# EAGLE design iSensor_SPI_Buffer_RevB (EAGLE 9.6.2)

## Sheet 1 of 3
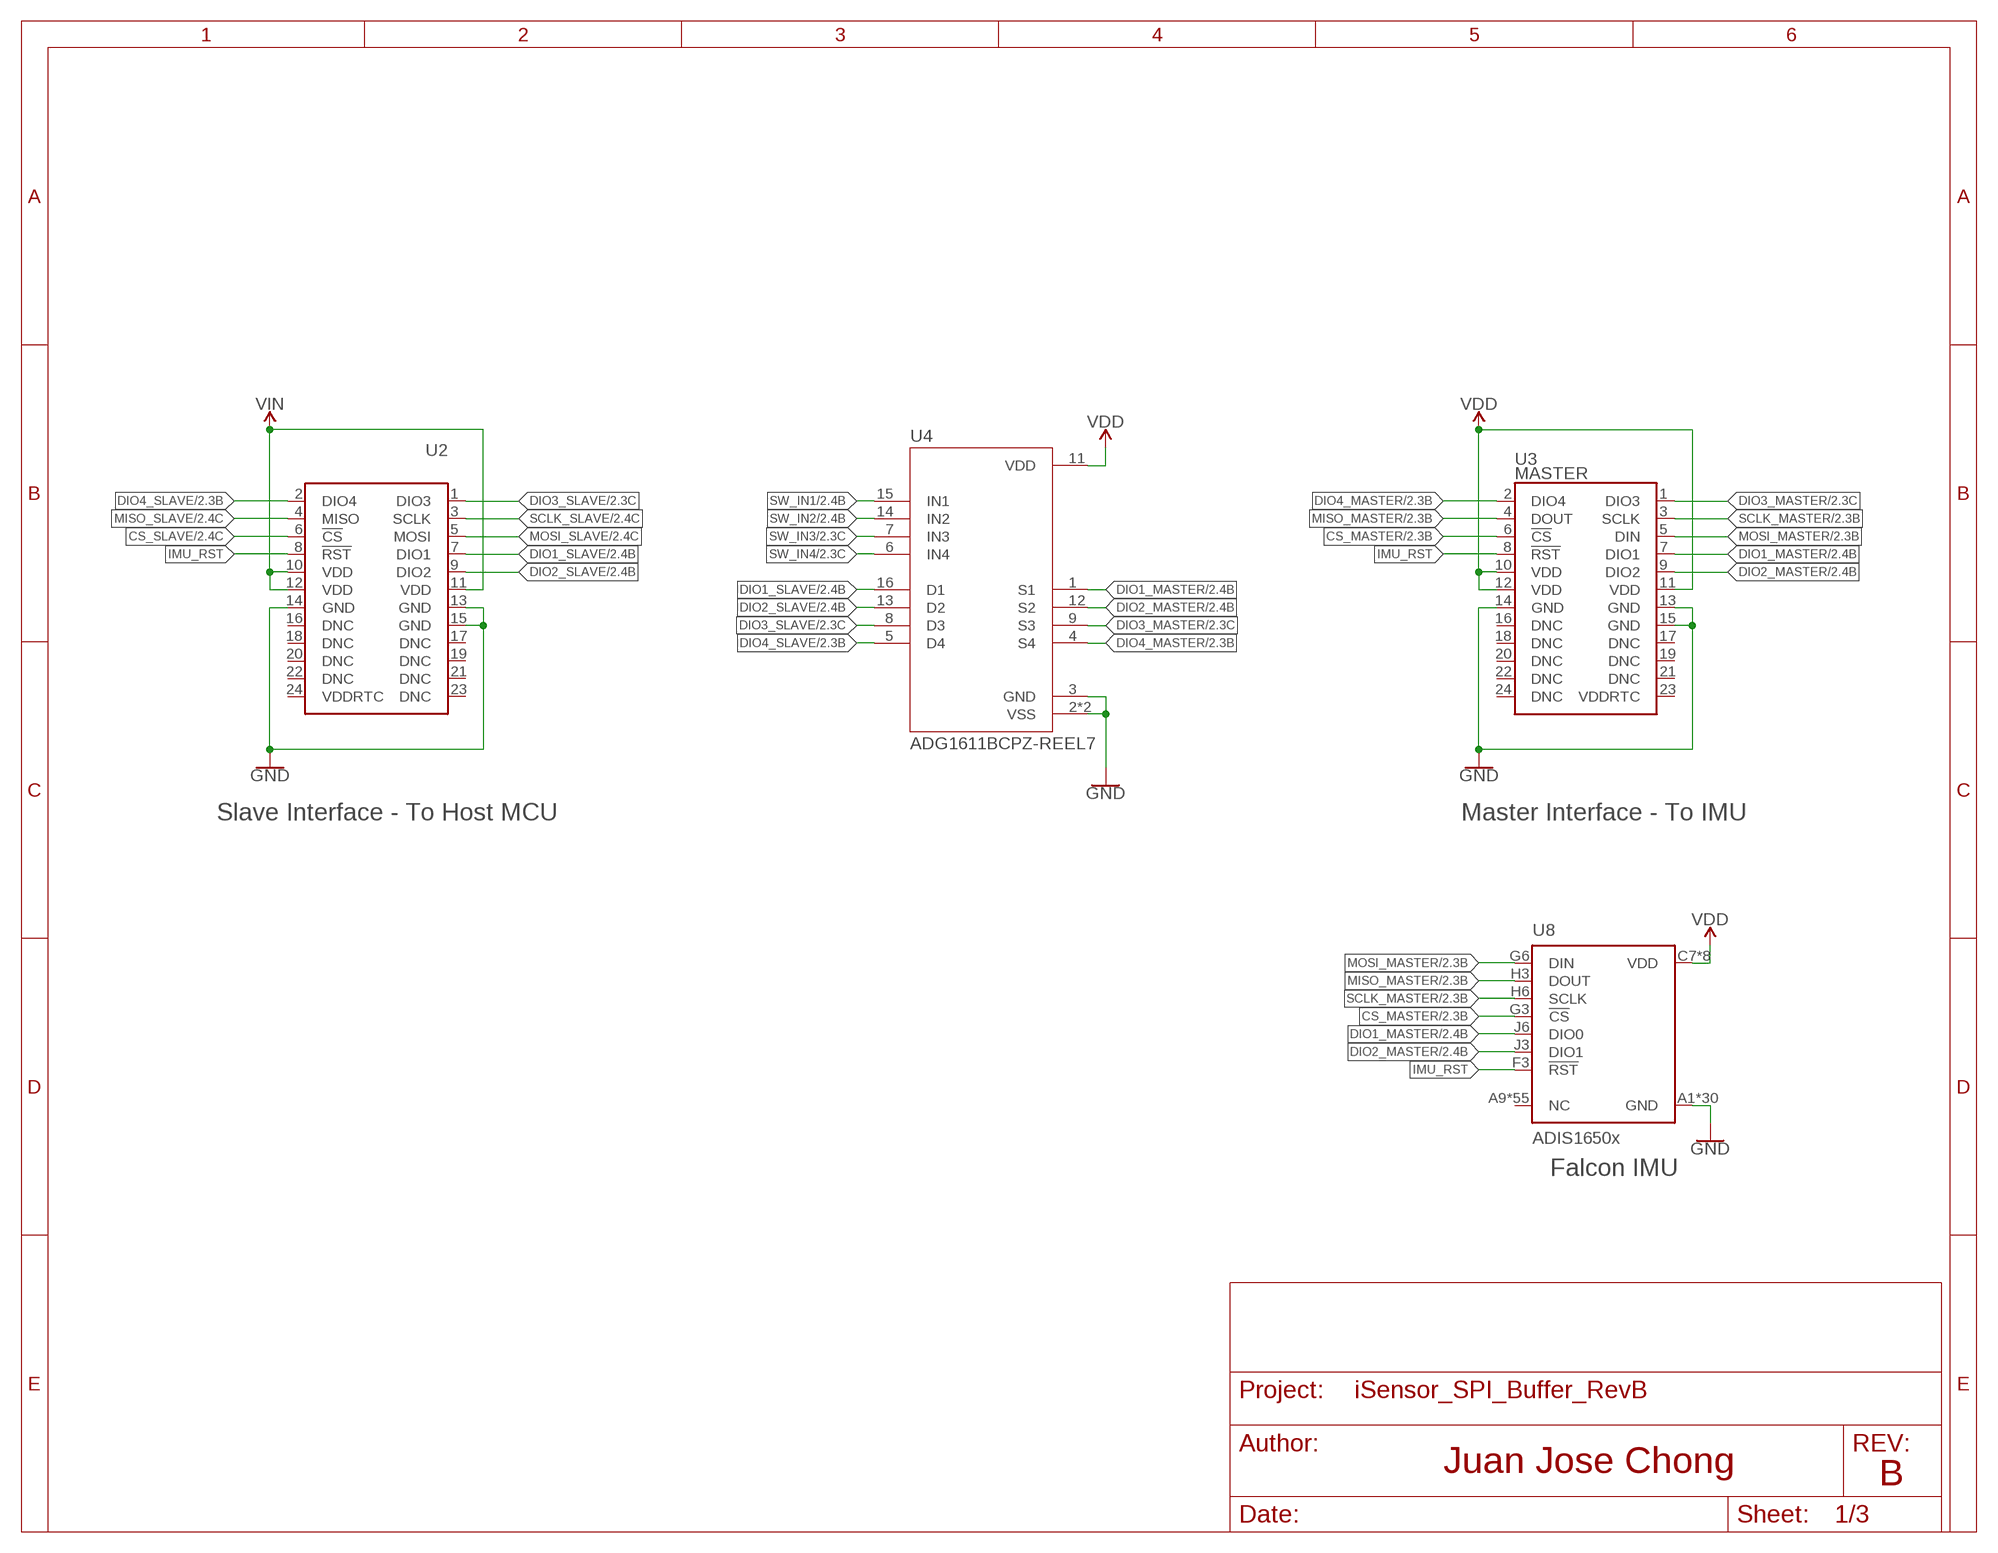
[diagram p0: schematic, sheet 1]

### Parts
U2  MW-12-03-H-D-130-112  [MW-12-03-H-D-130-112]
U3  MASTER  ADIS1648X  [ADIS1648X]
U4  ADG1611BCPZ-REEL7  [QFN65P400X400X80-17N]
U8  ADIS1650x  ADIS1650X  [ADIS1650X]

### Nets
CS_MASTER: U3.6(!CS) U8.G3(!CS) ; also sheet 2
CS_SLAVE: U2.6(!CS) ; also sheet 2
DIO1_MASTER: U3.7(DIO1) U4.1(S1) U8.J6(DIO0) ; also sheet 2
DIO1_SLAVE: U2.7(DIO1) U4.16(D1) ; also sheet 2
DIO2_MASTER: U3.9(DIO2) U4.12(S2) U8.J3(DIO1) ; also sheet 2
DIO2_SLAVE: U2.9(DIO2) U4.13(D2) ; also sheet 2
DIO3_MASTER: U3.1(DIO3) U4.9(S3) ; also sheet 2
DIO3_SLAVE: U2.1(DIO3) U4.8(D3) ; also sheet 2
DIO4_MASTER: U3.2(DIO4) U4.4(S4) ; also sheet 2
DIO4_SLAVE: U2.2(DIO4) U4.5(D4) ; also sheet 2
GND: U2.13(GND) U2.14(GND) U2.15(GND) U3.13(GND) U3.14(GND) U3.15(GND) U4.2(VSS) U4.3(GND) U4.17(VSS) U8.A1(GND) U8.A2(GND) U8.A3(GND) U8.A4(GND) U8.A5(GND) U8.A6(GND) U8.A7(GND) U8.A8(GND) U8.B3(GND) U8.B4(GND) U8.B5(GND) U8.B6(GND) U8.C2(GND) U8.C6(GND) U8.D3(GND) U8.E2(GND) U8.E6(GND) U8.E7(GND) U8.F1(GND) U8.F5(GND) U8.F6(GND) U8.F8(GND) U8.G2(GND) U8.G7(GND) U8.H8(GND) U8.J2(GND) U8.J7(GND) U8.K1(GND) U8.K3(GND) U8.K8(GND) ; also sheet 2,3
IMU_RST: U2.8(!RST) U3.8(!RST) U8.F3(!RST)
MISO_MASTER: U3.4(DOUT) U8.H3(DOUT) ; also sheet 2
MISO_SLAVE: U2.4(MISO) ; also sheet 2
MOSI_MASTER: U3.5(DIN) U8.G6(DIN) ; also sheet 2
MOSI_SLAVE: U2.5(MOSI) ; also sheet 2
SCLK_MASTER: U3.3(SCLK) U8.H6(SCLK) ; also sheet 2
SCLK_SLAVE: U2.3(SCLK) ; also sheet 2
SW_IN1: U4.15(IN1) ; also sheet 2
SW_IN2: U4.14(IN2) ; also sheet 2
SW_IN3: U4.7(IN3) ; also sheet 2
SW_IN4: U4.6(IN4) ; also sheet 2
VDD: U3.10(VDD) U3.11(VDD) U3.12(VDD) U4.11(VDD) U8.C7(VDD) U8.D6(VDD) U8.E3(VDD) U8.G1(VDD) U8.H1(VDD) U8.J4(VDD) U8.J5(VDD) U8.K6(VDD) ; also sheet 2,3
VIN: U2.10(VDD) U2.11(VDD) U2.12(VDD) ; also sheet 3
Unconnected: U2.16(DNC) U2.17(DNC) U2.18(DNC) U2.19(DNC) U2.20(DNC) U2.21(DNC) U2.22(DNC) U2.23(DNC) U2.24(VDDRTC) U3.16(DNC) U3.17(DNC) U3.18(DNC) U3.19(DNC) U3.20(DNC) U3.21(DNC) U3.22(DNC) U3.23(VDDRTC) U3.24(DNC) U8.A9(NC) U8.A10(NC) U8.B1(NC) U8.B2(NC) U8.B7(NC) U8.B8(NC) U8.B9(NC) U8.B10(NC) U8.C1(NC) U8.C3(NC) U8.C4(NC) U8.C5(NC) U8.C8(NC) U8.C9(NC) U8.C10(NC) U8.D1(NC) U8.D2(NC) U8.D4(NC) U8.D5(NC) U8.D7(NC) U8.D8(NC) U8.D9(NC) U8.D10(NC) U8.E1(NC) U8.E4(NC) U8.E5(NC) U8.E8(NC) U8.E9(NC) U8.E10(NC) U8.F2(NC) U8.F4(NC) U8.F7(NC) U8.F9(NC) U8.F10(NC) U8.G4(NC) U8.G5(NC) U8.G8(NC) U8.G9(NC) U8.G10(NC) U8.H2(NC) U8.H4(NC) U8.H5(NC) U8.H7(NC) U8.H9(NC) U8.H10(NC) U8.J1(NC) U8.J8(NC) U8.J9(NC) U8.J10(NC) U8.K2(NC) U8.K4(NC) U8.K5(NC) U8.K7(NC) U8.K9(NC) U8.K10(NC)

### Notes on the sheet
- Slave Interface - To Host MCU | Master Interface - To IMU
- Falcon IMU
- B

## Sheet 2 of 3
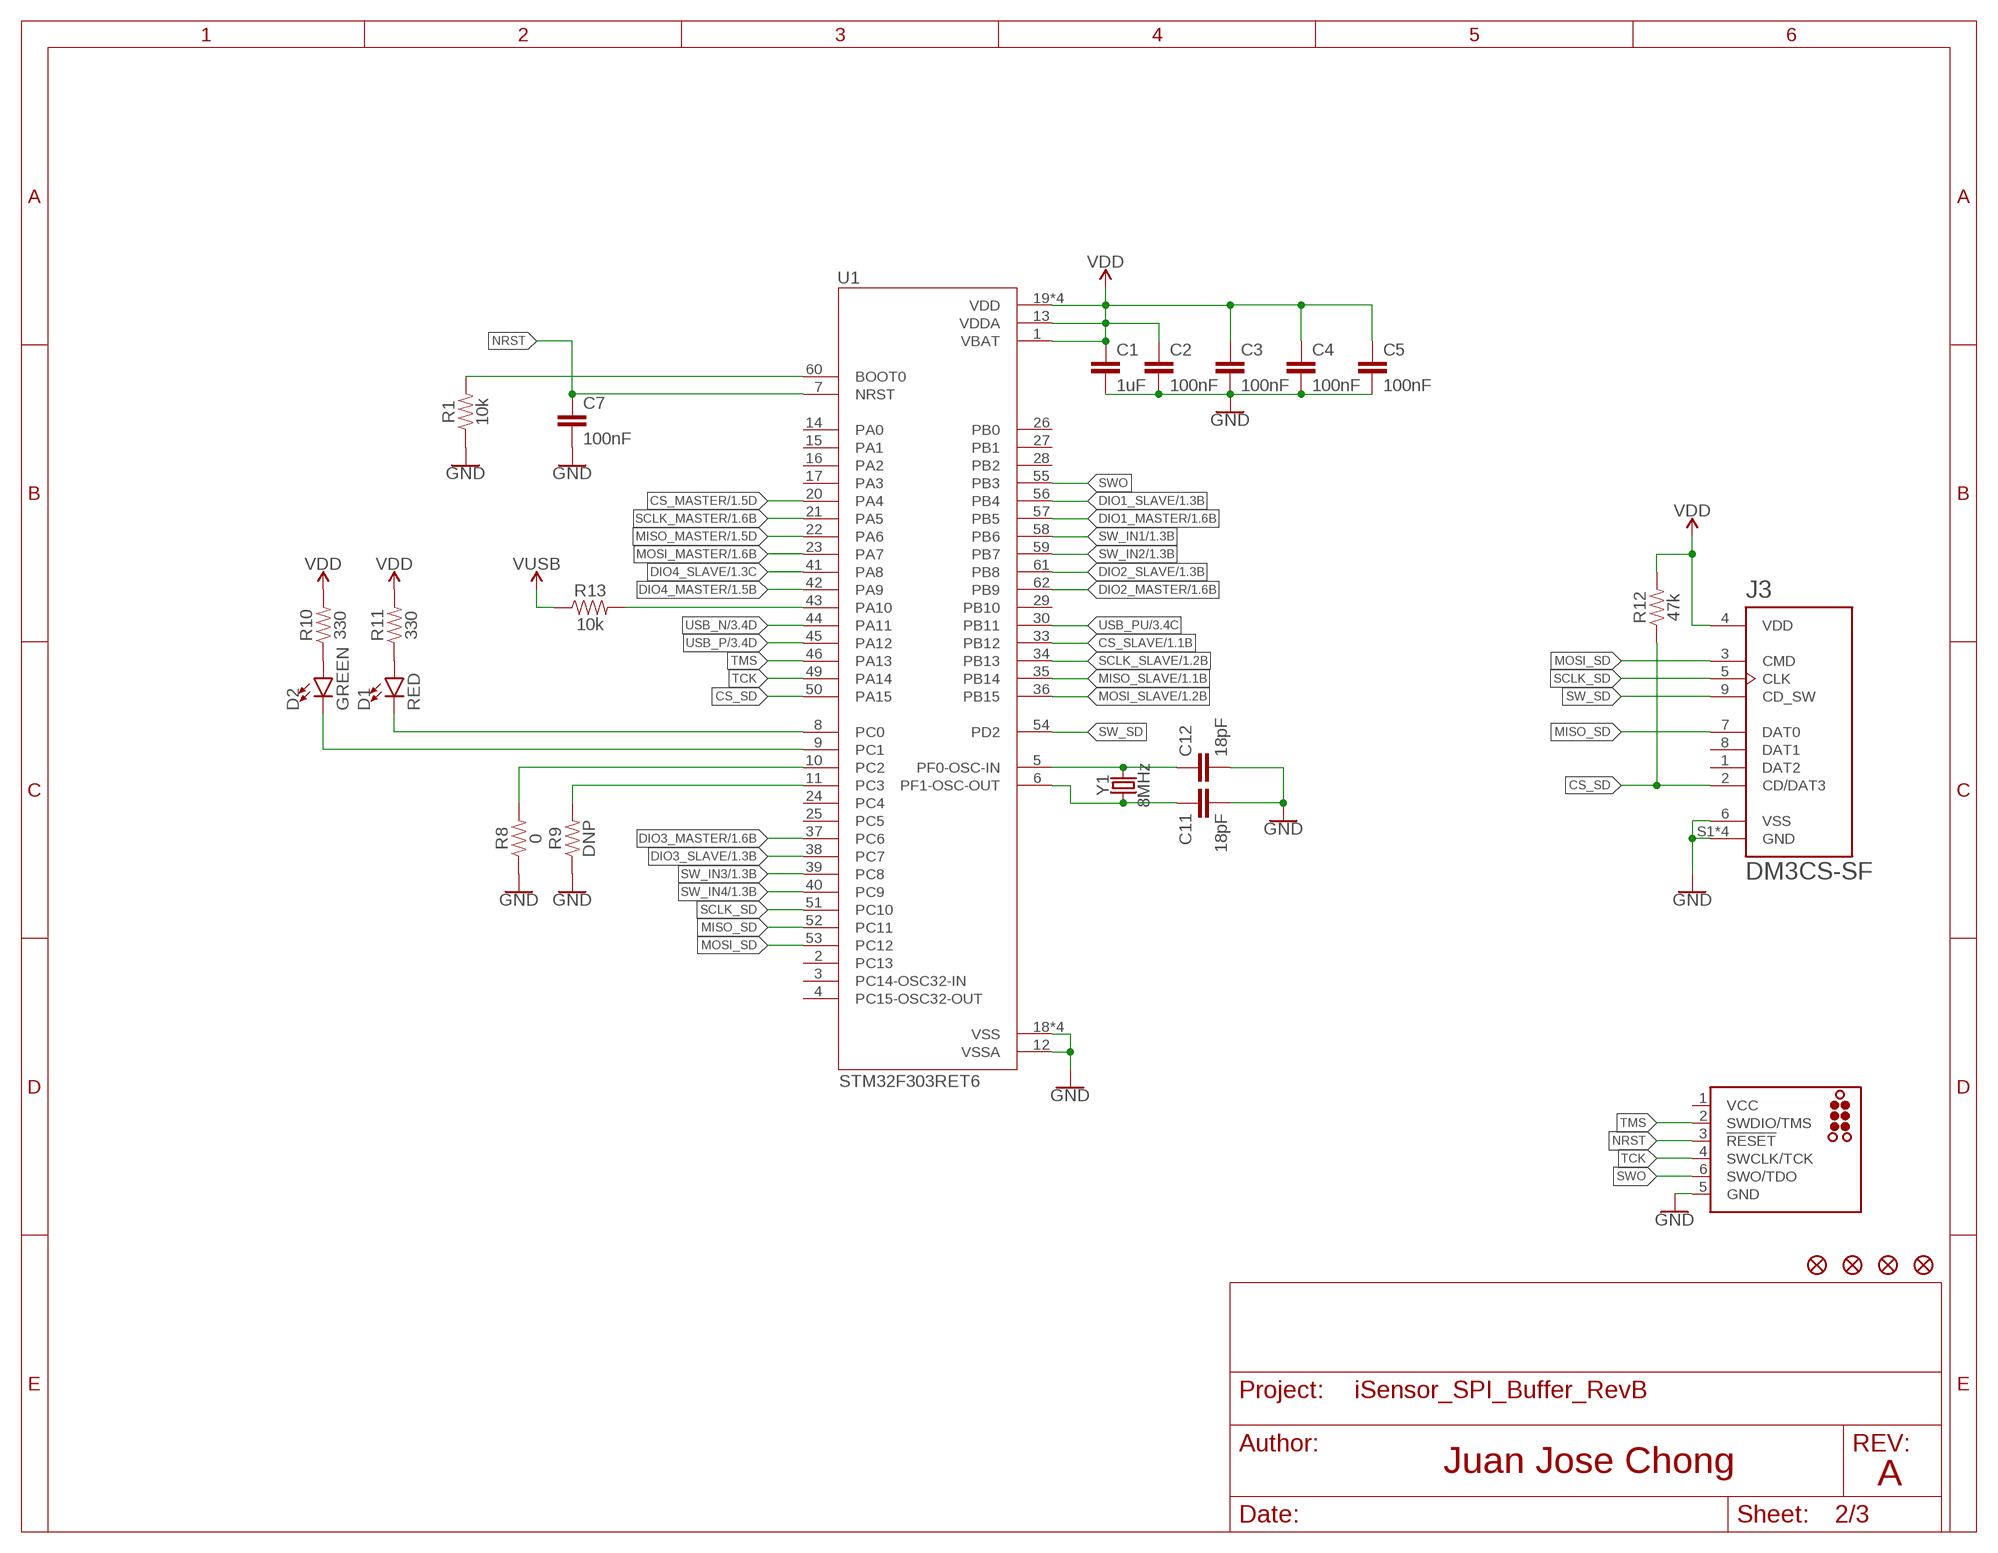
[diagram p1: schematic, sheet 2]

### Parts
C1  1uF  CAP-0603  [0603]
C2  100nF  CAP-0603  [0603]
C3  100nF  CAP-0603  [0603]
C4  100nF  CAP-0603  [0603]
C5  100nF  CAP-0603  [0603]
C7  100nF  CAP-0603  [0603]
C11  18pF  CAP-0402  [0402]
C12  18pF  CAP-0402  [0402]
D1  RED  LED-RED0603  [LED-0603]
D2  GREEN  LED-GREEN0603  [LED-0603]
FD1  FIDUCIAL1X2  [FIDUCIAL-1X2]
FD2  FIDUCIAL1X2  [FIDUCIAL-1X2]
FD3  FIDUCIAL1X2  [FIDUCIAL-1X2]
FD4  FIDUCIAL1X2  [FIDUCIAL-1X2]
J1  TC2030_SWD-MCP  [TC2030-MCP]
J3  DM3CS-SF  [HRS_DM3CS-SF]
R1  10k  RESISTOR0402  [0402]
R8  0  RESISTOR0402  [0402]
R9  DNP  RESISTOR0402  [0402]
R10  330  RESISTOR0402  [0402]
R11  330  RESISTOR0402  [0402]
R12  47k  RESISTOR0402  [0402]
R13  10k  RESISTOR0402  [0402]
U1  STM32F303RET6  [QFP50P1200X1200X160-64N]
Y1  8MHz  CRYSTAL-8MHZSMD-5X3.2  [CRYSTAL-SMD-5X3.2-4PAD]

### Nets
CS_MASTER: U1.20(PA4) ; also sheet 1
CS_SD: J3.2(CD/DAT3) R12.1 U1.50(PA15)
CS_SLAVE: U1.33(PB12) ; also sheet 1
DIO1_MASTER: U1.57(PB5) ; also sheet 1
DIO1_SLAVE: U1.56(PB4) ; also sheet 1
DIO2_MASTER: U1.62(PB9) ; also sheet 1
DIO2_SLAVE: U1.61(PB8) ; also sheet 1
DIO3_MASTER: U1.37(PC6) ; also sheet 1
DIO3_SLAVE: U1.38(PC7) ; also sheet 1
DIO4_MASTER: U1.42(PA9) ; also sheet 1
DIO4_SLAVE: U1.41(PA8) ; also sheet 1
GND: C1.2 C2.2 C3.2 C4.2 C5.2 C7.2 C11.2 C12.2 J1.5(GND) J3.6(VSS) J3.S1(GND) J3.S2(GND) J3.S3(GND) J3.S5(GND) R1.1 R8.1 R9.1 U1.12(VSSA) U1.18(VSS) U1.31(VSS) U1.47(VSS) U1.63(VSS) ; also sheet 1,3
MISO_MASTER: U1.22(PA6) ; also sheet 1
MISO_SD: J3.7(DAT0) U1.52(PC11)
MISO_SLAVE: U1.35(PB14) ; also sheet 1
MOSI_MASTER: U1.23(PA7) ; also sheet 1
MOSI_SD: J3.3(CMD) U1.53(PC12)
MOSI_SLAVE: U1.36(PB15) ; also sheet 1
N$1: R1.2 U1.60(BOOT0)
N$7: D1.C U1.8(PC0)
N$8: D2.C U1.9(PC1)
N$9: R8.2 U1.10(PC2)
N$10: R9.2 U1.11(PC3)
N$11: D2.A R10.1
N$12: D1.A R11.1
N$13: R13.2 U1.43(PA10)
N$14: C11.1 U1.6(PF1-OSC-OUT) Y1.1
N$15: C12.1 U1.5(PF0-OSC-IN) Y1.3
NRST: C7.1 J1.3(!RESET) U1.7(NRST)
SCLK_MASTER: U1.21(PA5) ; also sheet 1
SCLK_SD: J3.5(CLK) U1.51(PC10)
SCLK_SLAVE: U1.34(PB13) ; also sheet 1
SW_IN1: U1.58(PB6) ; also sheet 1
SW_IN2: U1.59(PB7) ; also sheet 1
SW_IN3: U1.39(PC8) ; also sheet 1
SW_IN4: U1.40(PC9) ; also sheet 1
SW_SD: J3.9(CD_SW) U1.54(PD2)
SWO: J1.6(SWO/TDO) U1.55(PB3)
TCK: J1.4(SWCLK/TCK) U1.49(PA14)
TMS: J1.2(SWDIO/TMS) U1.46(PA13)
USB_N [usb]: U1.44(PA11) ; also sheet 3
USB_P [usb]: U1.45(PA12) ; also sheet 3
USB_PU: U1.30(PB11) ; also sheet 3
V_USB: R13.1 ; supply symbol labelled VUSB ; also sheet 3
VDD: C1.1 C2.1 C3.1 C4.1 C5.1 J3.4(VDD) R10.2 R11.2 R12.2 U1.1(VBAT) U1.13(VDDA) U1.19(VDD) U1.32(VDD) U1.48(VDD) U1.64(VDD) ; also sheet 1,3
Unconnected: J1.1(VCC) J3.1(DAT2) J3.8(DAT1) U1.2(PC13) U1.3(PC14-OSC32-IN) U1.4(PC15-OSC32-OUT) U1.14(PA0) U1.15(PA1) U1.16(PA2) U1.17(PA3) U1.24(PC4) U1.25(PC5) U1.26(PB0) U1.27(PB1) U1.28(PB2) U1.29(PB10)

### Notes on the sheet
- A

## Sheet 3 of 3
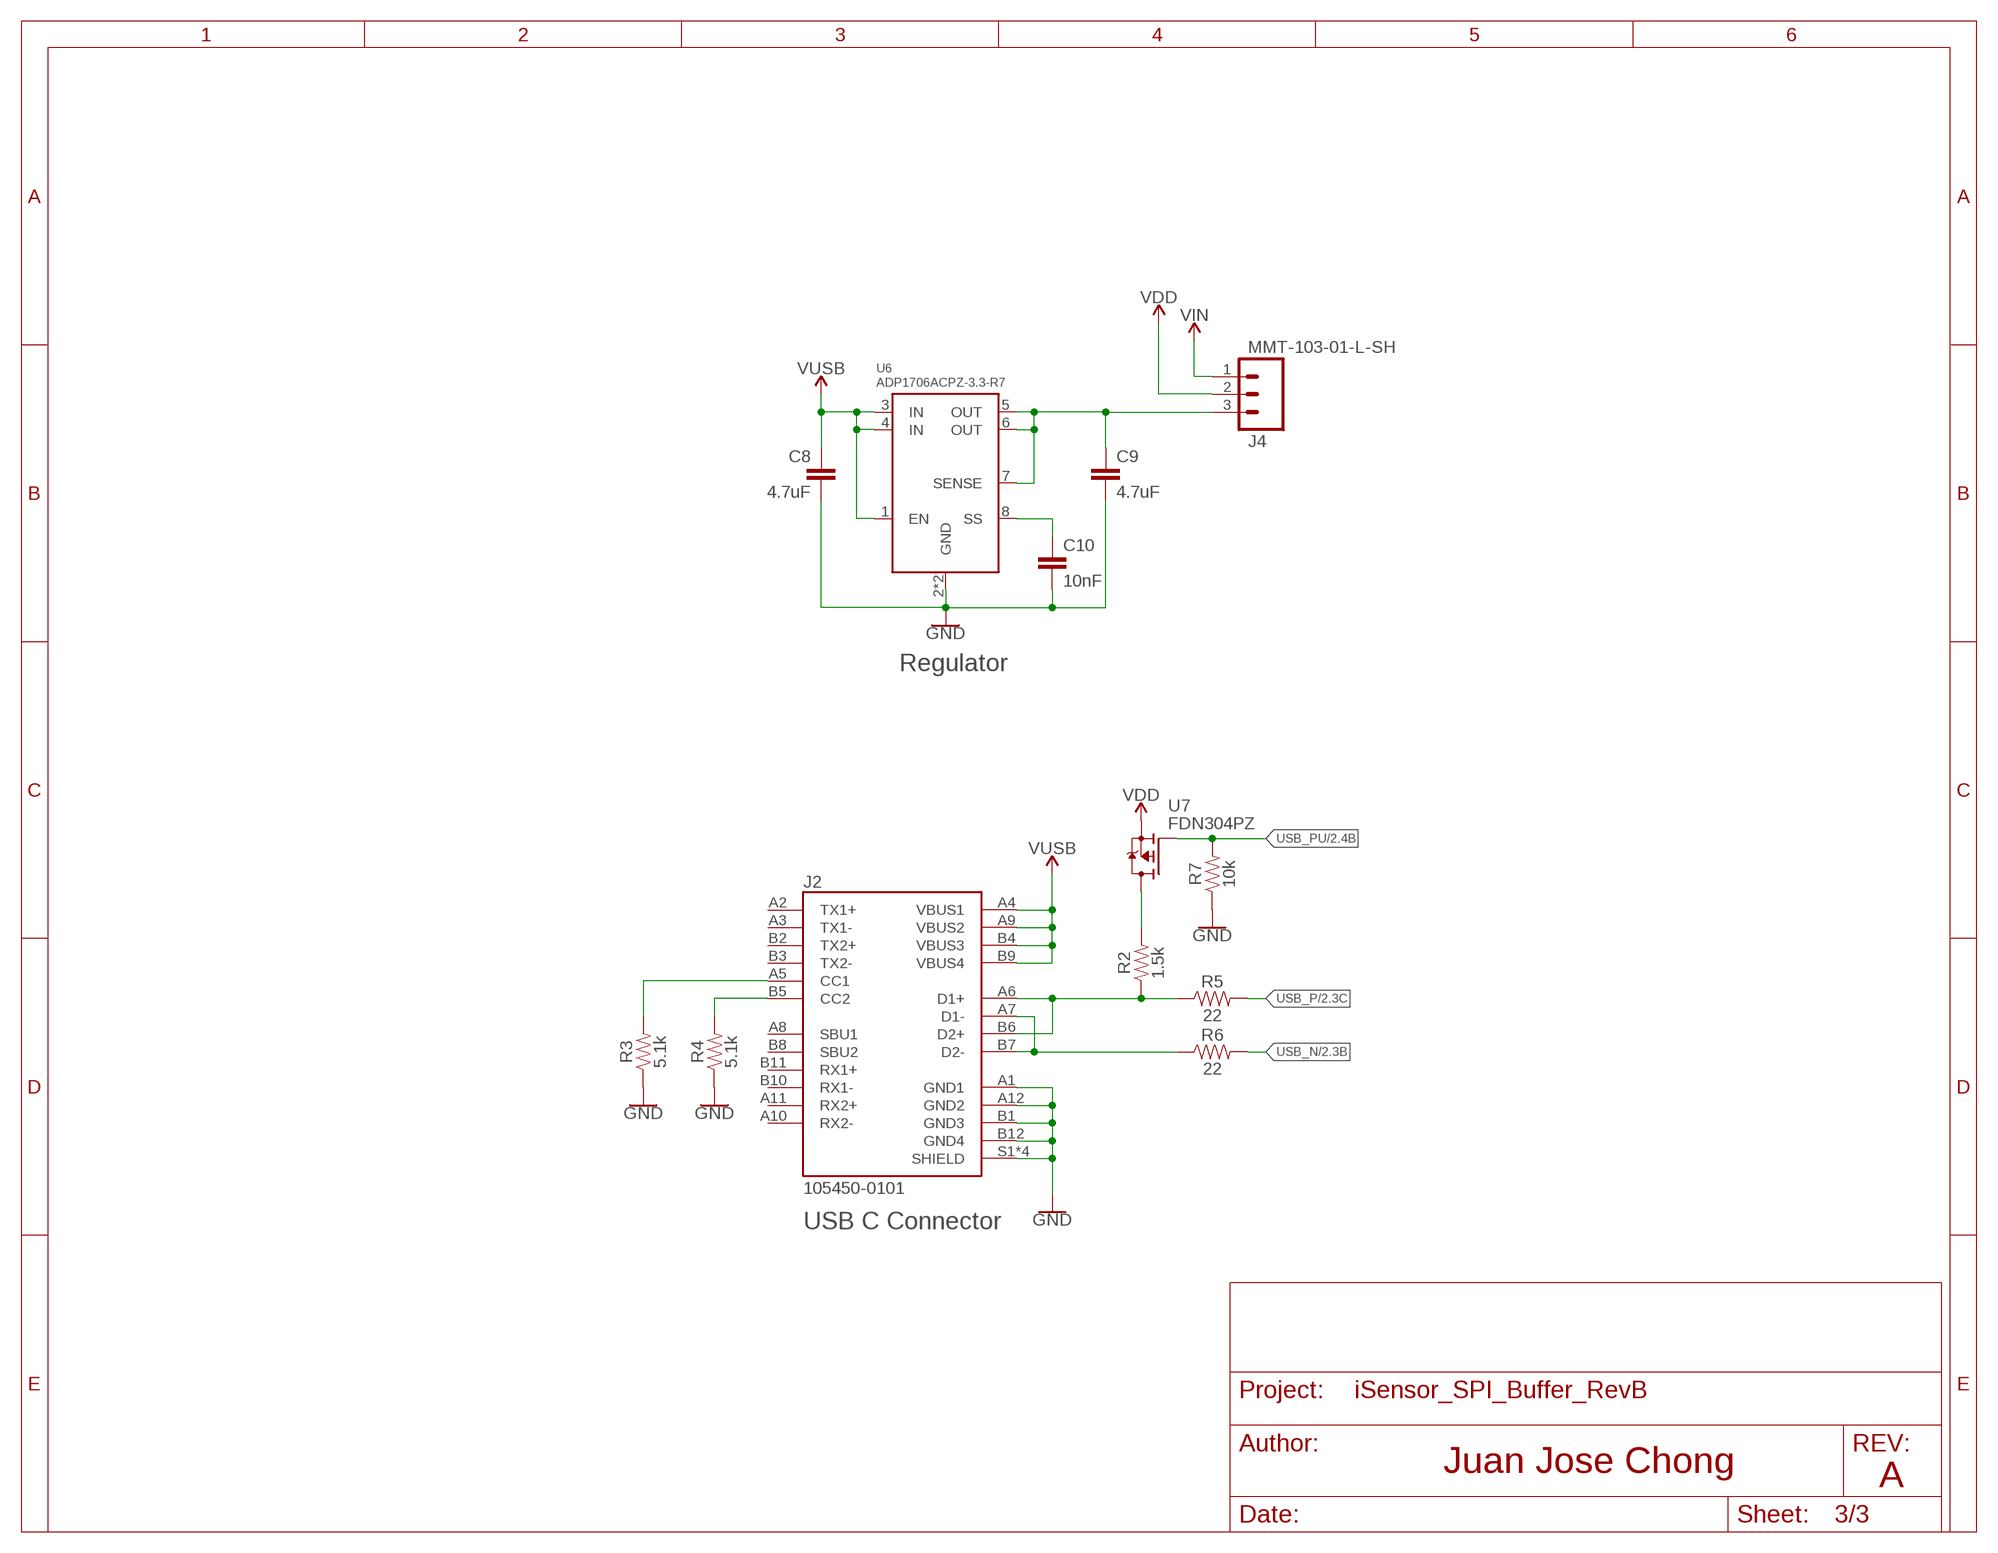
[diagram p2: schematic, sheet 3]

### Parts
C8  4.7uF  CAP-0805  [0805]
C9  4.7uF  CAP-0805  [0805]
C10  10nF  CAP-0603  [0603]
J2  105450-0101  [MOLEX_105450-0101]
J4  MMT-103-01-L-SH  M03MMT-103-01-L-SH  [SAMTEC-MMT-103-01-X-SH]
R2  1.5k  RESISTOR0402  [0402]
R3  5.1k  RESISTOR0402  [0402]
R4  5.1k  RESISTOR0402  [0402]
R5  22  RESISTOR0402  [0402]
R6  22  RESISTOR0402  [0402]
R7  10k  RESISTOR0402  [0402]
U6  ADP1706ACPZ-3.3-R7  [DFN300X300X90-9N]
U7  FDN304PZ  [SOT23]

### Nets
GND: C8.2 C9.2 C10.2 J2.A1(GND1) J2.A12(GND2) J2.B1(GND3) J2.B12(GND4) J2.S1(SHIELD) J2.S2(SHIELD) J2.S3(SHIELD) J2.S4(SHIELD) R3.1 R4.1 R7.1 U6.2(GND) U6.9(GND) ; also sheet 1,2
N$2: J2.A5(CC1) R3.2
N$3: J2.B5(CC2) R4.2
N$4: C9.1 J4.3 U6.5(OUT) U6.6(OUT) U6.7(SENSE)
N$5: R2.2 U7.3(D)
N$6: C10.1 U6.8(SS)
USB+_N [usb]: J2.A7(D1-) J2.B7(D2-) R6.1
USB+_P [usb]: J2.A6(D1+) J2.B6(D2+) R2.1 R5.1
USB_N [usb]: R6.2 ; also sheet 2
USB_P [usb]: R5.2 ; also sheet 2
USB_PU: R7.2 U7.1(G) ; also sheet 2
V_USB: C8.1 J2.A4(VBUS1) J2.A9(VBUS2) J2.B4(VBUS3) J2.B9(VBUS4) U6.1(EN) U6.3(IN) U6.4(IN) ; supply symbol labelled VUSB ; also sheet 2
VDD: J4.2 U7.2(S) ; also sheet 1,2
VIN: J4.1 ; also sheet 1
Unconnected: J2.A2(TX1+) J2.A3(TX1-) J2.A8(SBU1) J2.A10(RX2-) J2.A11(RX2+) J2.B2(TX2+) J2.B3(TX2-) J2.B8(SBU2) J2.B10(RX1-) J2.B11(RX1+)

### Notes on the sheet
- Regulator
- USB C Connector
- A

## Library data of the parts
C1-C5 C7-C12 = SparkFun-Capacitors:CAP
D1 = SparkFun-LED:LED-RED: Red SMD LED Used in manufacturing of most products at SparkFun Packages: 0603 - SMD 0603 package [Product Link] <http://docs.avagotech.com/docs/AV02-0551EN> 0603 SMART - SMD 0603 SMART package ( more efficient and expensive)[Product Link] <http://www.osram-os.com/Graphics/XPic2/00077099_0.pdf> 1206 - SMD1206 package [Product Link] <https://www.sparkfun.com/datasheets/DevTools/LilyPad/Q150OVS4.pdff> SparkFun Products: Pro Mini 328 -5V <https://www.sparkfun.com/products/821> RedBoard <https://www.sparkfun.com/products/12757> IOIO-OTG <https://www.sparkfun.com/products/13613>; PROD_ID: DIO-00819
D2 = SparkFun-LED:LED-GREEN: Green SMD LED Used in manufacturing of various products at SparkFun Packages: 0603 - SMD 0603 package [Product Link] <http://www.futureelectronics.com/en/technologies/semiconductors/optoelectronics/leds/Pages/9894312-LTST-C190GKT.aspx?CrossPart=HSMG-C190&IM=0> LilyPad 1206 - SMD1206 LilyPad package [Product Link] <http://www.futureelectronics.com/en/Technologies/Product.aspx?ProductID=IN150NGHARVATEKCORPORATION2049943&IM=0> 1206 - SMD1206 package [Product Link] <http://www.futureelectronics.com/en/technologies/semiconductors/optoelectronics/leds/Pages/8315665-LTST-C150KGKT.aspx?IM=0> 1206 Bottom Mount -SMD 1206 Bottom Mount [Product Link] <http://www.digikey.com/product-detail/en/lite-on-inc/LTST-C230KGKT/160-1456-1-ND/386854> SparkFun Products: Pro Mini 328 -5V <https://www.sparkfun.com/products/821> RedBoard <https://www.sparkfun.com/products/12757> MP3 Trigger <https://www.sparkfun.com/products/13720> Makey Makey <https://www.sparkfun.com/products/11076>; PROD_ID: DIO-00821
FD1-FD4 = SparkFun-Aesthetics:FIDUCIAL: Fiducial Alignment Points Point-of-reference for pick-and-place machines and other optical instruments.
J1 = tag-connect:TC2030_SWD: ARM20-CTX 20-Pin to TC2030-IDC Adapter for Cortex 6-Pin (TC2030-IDC family) </catalog/6> Cortex SWD </catalog/9> Adapters </adaptors> <javascript:void(0);> The Tag-Connect ARM20-CTX adapter board allows our TC2030-IDC cables to be used for ARM SWD (Single Wire Debug) applications. Although intended for use with our patented TC2030-IDC (and TC2030-IDC-NL) Plug-of-Nails™ Cables, the adapter may be useful to people wishing to use 6-pin 0.1” ribbon headers on their PCB instead of the traditional 20-Pin header. Please note the TC2030-IDC <http://tag-connect.com/TC2030-IDC> or TC2030-IDC-NL <http://tag-connect.com/TC2030-IDC-NL> cable is purchased separately, the cables and Segger JLINK seen in the pictures are not included! Download the Datasheet here. <http://www.tag-connect.com/Materials/ARM20-CTX.pdf>
J2 = 105450-0101:105450-0101: USB Shielded I/O Receptacle; Type C; Right Angle; Surface Mount; Gold over Nickel; AVAILABILITY: Unavailable; DESCRIPTION: USB-C _USB TYPE-C_ USB 3.1 _USB 3.1 Gen 2, Superspeed+_ Receptacle Connector 24 Position Surface Mount, Right Angle; Through Hole; MF: Molex; MP: 1054500101; PACKAGE: None; PRICE: None
J3 = DM3CS-SF:DM3CS-SF: CONN MICRO SD CARD HINGED TYPE; DESCRIPTION: 10 _8 + 2_ Position Card Connector Secure Digital - microSD™ Surface Mount, Right Angle Gold; DIGI-KEY_PART_NUMBER: HR1972CT-ND; DIGI-KEY_PURCHASE_URL: https://www.digikey.com/product-detail/en/hirose-electric-co-ltd/DM3CS-SF/HR1972CT-ND/2602740?utm_source=snapeda&utm_medium=aggregator&utm_campaign=symbol; MF: Hirose; MP: DM3CS-SF; PACKAGE: None
J4 = Chong:M03: Header 3 Standard 3-pin 0.1" header. Use with straight break away headers (SKU : PRT-00116), right angle break away headers (PRT-00553), swiss pins (PRT-00743), machine pins (PRT-00117), and female headers (PRT-00115). Molex polarized connector foot print use with SKU : PRT-08232 with associated crimp pins and housings.
R1-R13 = SparkFun-Resistors:RESISTOR: Generic Resistor Package
U1 = STM32F303RET6:STM32F303RET6: MCU 32-Bit STM32 ARM Cortex M4 RISC 512KB Flash 2.5V/3.3V 64-Pin LQFP Tray; AVAILABILITY: Unavailable; DESCRIPTION: ARM® Cortex®-M4 STM32F3 Microcontroller IC 32-Bit 72MHz 512KB _512K x 8_ FLASH 64-LQFP _10x10_; MF: STMicroelectronics; MP: STM32F303RET6; PACKAGE: LQFP-64 STMicroelectronics; PRICE: None
U2 = Analog Devices iSensors:MW-12-03-H-D-130-112
U3 = Analog Devices iSensors:ADIS1648X
U4 = ADG1611BCPZ-REEL7:ADG1611BCPZ-REEL7: Analog Switch Quad SPST 16-Pin LFCSP EP T/R; AVAILABILITY: Unavailable; DESCRIPTION: Analog Switch Quad SPST 16-Pin LFCSP EP T/R; MF: Analog Devices; MP: ADG1611BCPZ-REEL7; PACKAGE: LFCSP -16 Analog Devices; PRICE: None
U6 = AnalogDevices:ADP1706ACPZ-3.3-R7
U7 = transistor-fet-mod:FDN304PZ
U8 = Analog Devices iSensors:ADIS1650X
Y1 = SparkFun-Clocks:CRYSTAL-8MHZ: 8MHz Crystal Datasheet Example <http://www.futureelectronics.com/en/technologies/electromechanical/timing-devices/crystals/Pages/6008189-ABM3B-8.000MHZ-B2-T.aspx?IM=0> Frequency: 8MHz Frequency Tolerance: ±20ppm Load Capacitance: 18pF SparkFun Products: Pro Micro -3.3V/8MHz <https://www.sparkfun.com/products/12587> WAV Trigger <https://www.sparkfun.com/products/13660>; PROD_ID: XTAL-09431

## Board
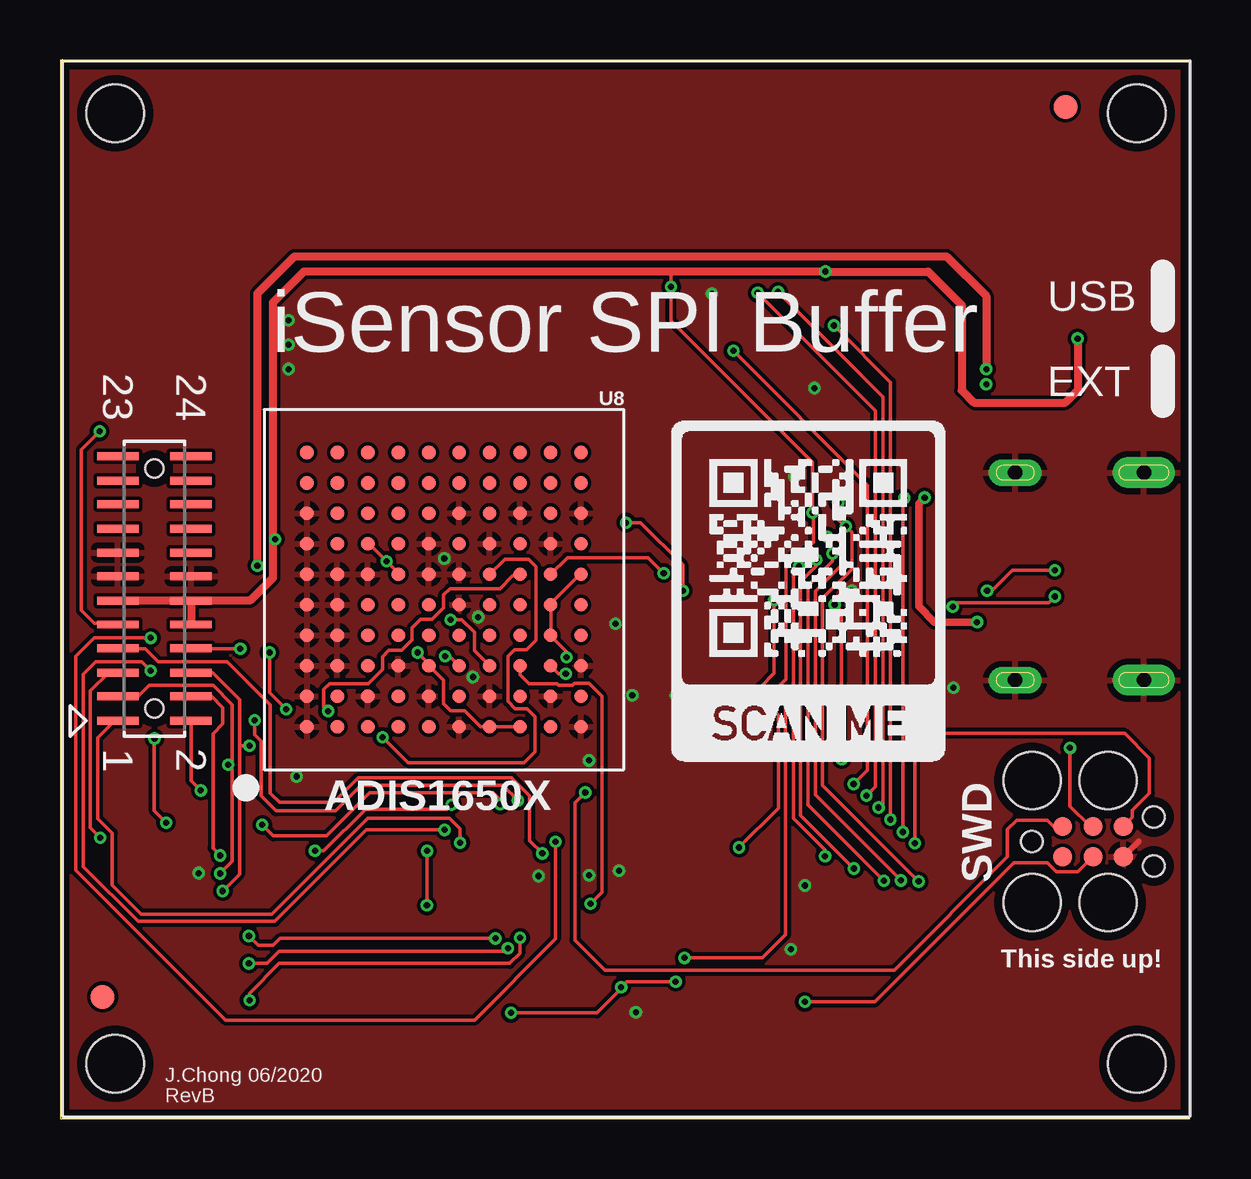
[diagram p3: board, top side]
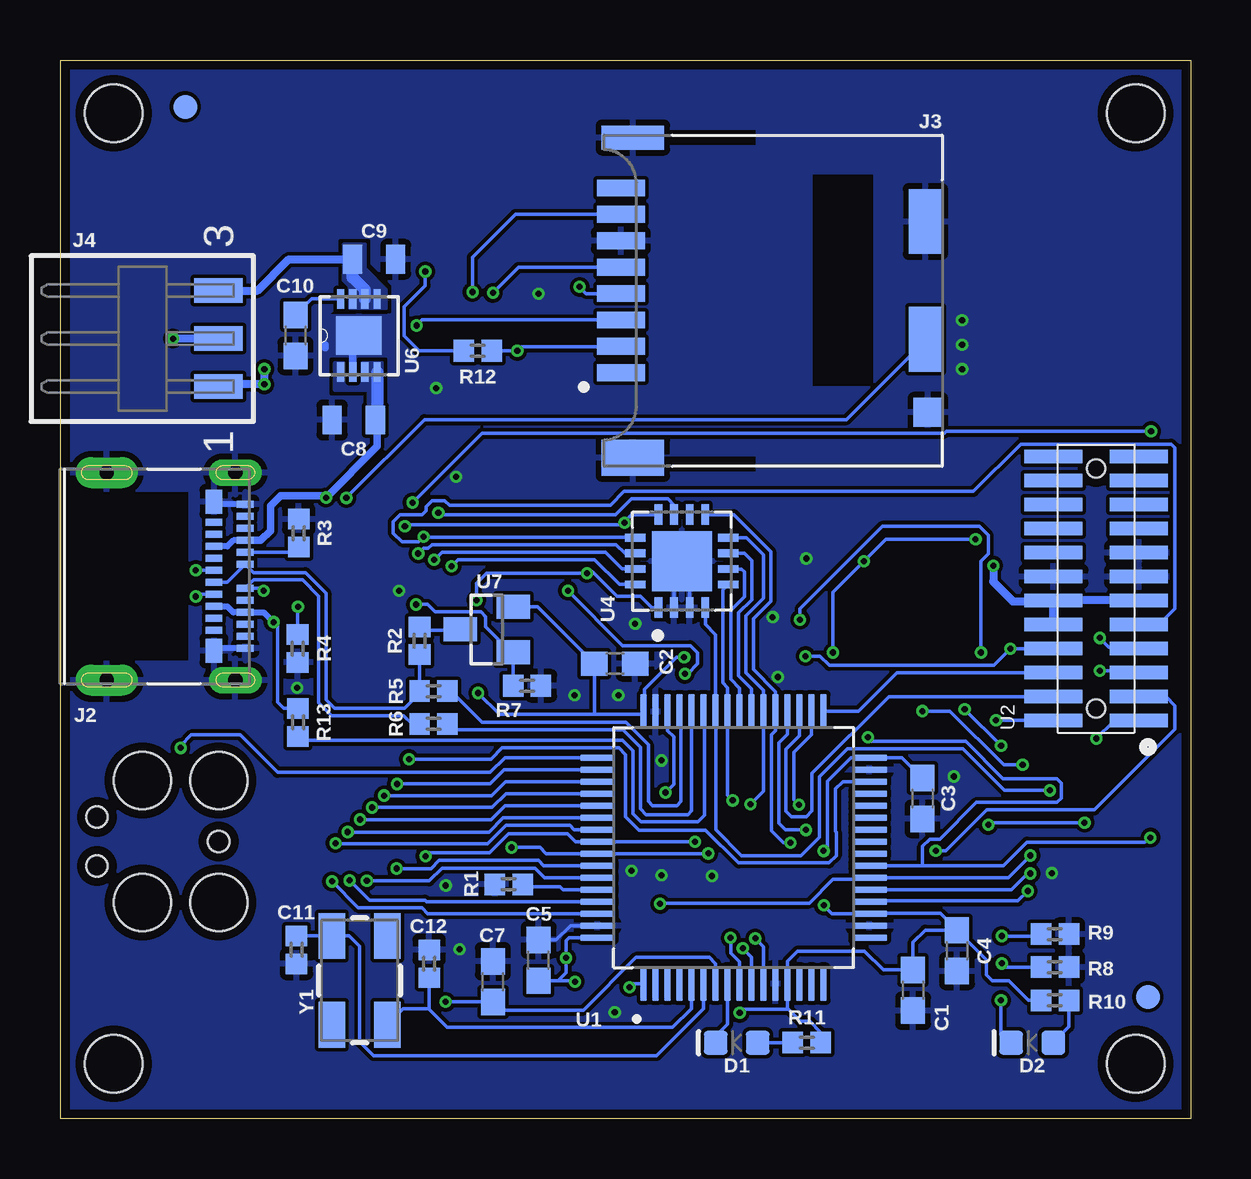
[diagram p4: board, bottom side, seen from below]

Size 47.1 x 44.12 mm. Coordinates in mm from the lower left corner, seen from the top.
Outline: 0,0 47.1,0 47.1,44.12 0,44.12 0,0
Copper layers (1*16): Top 0.035559375mm / dielectric 1.6mm / Bottom 0.035559375mm
Design rules "oshpark-2layer *": minimum track width 6mil, minimum drill 10mil, track to track 6mil, track to pad 6mil, pad to pad 6mil, via to via 6mil, smd to smd 6mil, copper to edge 15mil, drill to drill 6mil, minimum pad ring 5mil, minimum via ring 5mil, stop-mask expansion 2.5mil, vias tented up to drill 12mil, thermal gap 10mil

### Footprints (pad centres in the part's own frame; a part is rotated, then mirrored left to right if it is on the bottom)
0603 = smd 1.1 x 1: 1 -0.85,0; 2 0.85,0
0805 = smd 0.8 x 1.2: 1 -0.9,0; 2 0.9,0
0402 = smd 0.85 x 0.9: 1 -0.58,0; 2 0.58,0
LED-0603 = smd 1 x 1: A -0.877,0; C 0.877,0
FIDUCIAL-1X2 = smd 1 x 1: 1 0,0
TC2030-MCP = smd 0.787 x 0.787: 1 1.27,-0.635; 2 1.27,0.635; 3 2.54,-0.635; 4 2.54,0.635; 5 3.81,-0.635; 6 3.81,0.635 | hole 0.889: 0,0; 5.08,-1.016; 5.08,1.016 | hole 2.375: 0,2.54; 0,-2.54; 3.175,-2.54; 3.175,2.54
MOLEX_105450-0101 = smd 0.3 x 0.7: A1 -3,3.77; A2 -2.5,3.77; A3 -2,3.77; A4 -1.5,3.77; A5 -1,3.77; A6 -0.5,3.77; A7 0.5,3.77; A8 1,3.77; A9 1.5,3.77; A10 2,3.77; A11 2.5,3.77; A12 3,3.77; B2 2.25,2.47; B3 1.75,2.47; B4 1.25,2.47; B5 0.75,2.47; B6 0.25,2.47; B7 -0.25,2.47; B8 -0.75,2.47; B9 -1.25,2.47; B10 -1.75,2.47; B11 -2.25,2.47 | smd 1 x 0.7: B1 3.1,2.47; B12 -3.1,2.47 | drill 0.6 pad 1.1 long: S1 -4.32,3.36; S2 4.32,3.36 | drill 0.6 pad 1.3 long: S3 -4.32,-2; S4 4.32,-2
HRS_DM3CS-SF = smd 0.7 x 2: 1 3.2,-6.35; 2 2.1,-6.35; 3 1,-6.35; 4 -0.1,-6.35; 5 -1.2,-6.35; 6 -2.3,-6.35; 7 -3.4,-6.35; 8 -4.5,-6.35 | smd 2.7 x 1.4: 9 1.8,6.35; S3 -3.1,6.35 | smd 1 x 2.6: S1 -6.6,-5.85 | smd 1.5 x 2.6: S2 6.75,-5.85 | smd 1.2 x 1.2: S5 4.85,6.45
SAMTEC-MMT-103-01-X-SH = smd 1.02 x 2.03: 1 -2,-3.159; 2 0,-3.159; 3 2,-3.159
QFP50P1200X1200X160-64N = smd 1.47 x 0.28: 1 -5.67,3.75; 2 -5.67,3.25; 3 -5.67,2.75; 4 -5.67,2.25; 5 -5.67,1.75; 6 -5.67,1.25; 7 -5.67,0.75; 8 -5.67,0.25; 9 -5.67,-0.25; 10 -5.67,-0.75; 11 -5.67,-1.25; 12 -5.67,-1.75; 13 -5.67,-2.25; 14 -5.67,-2.75; 15 -5.67,-3.25; 16 -5.67,-3.75; 33 5.67,-3.75; 34 5.67,-3.25; 35 5.67,-2.75; 36 5.67,-2.25; 37 5.67,-1.75; 38 5.67,-1.25; 39 5.67,-0.75; 40 5.67,-0.25; 41 5.67,0.25; 42 5.67,0.75; 43 5.67,1.25; 44 5.67,1.75; 45 5.67,2.25; 46 5.67,2.75; 47 5.67,3.25; 48 5.67,3.75 | smd 0.28 x 1.47: 17 -3.75,-5.67; 18 -3.25,-5.67; 19 -2.75,-5.67; 20 -2.25,-5.67; 21 -1.75,-5.67; 22 -1.25,-5.67; 23 -0.75,-5.67; 24 -0.25,-5.67; 25 0.25,-5.67; 26 0.75,-5.67; 27 1.25,-5.67; 28 1.75,-5.67; 29 2.25,-5.67; 30 2.75,-5.67; 31 3.25,-5.67; 32 3.75,-5.67; 49 3.75,5.67; 50 3.25,5.67; 51 2.75,5.67; 52 2.25,5.67; 53 1.75,5.67; 54 1.25,5.67; 55 0.75,5.67; 56 0.25,5.67; 57 -0.25,5.67; 58 -0.75,5.67; 59 -1.25,5.67; 60 -1.75,5.67; 61 -2.25,5.67; 62 -2.75,5.67; 63 -3.25,5.67; 64 -3.75,5.67
MW-12-03-H-D-130-112 = smd 0.559 x 2.413: 1 -5.5,-1.78; 2 -5.5,1.78; 3 -4.5,-1.78; 4 -4.5,1.78; 5 -3.5,-1.78; 6 -3.5,1.78; 7 -2.5,-1.78; 8 -2.5,1.78; 9 -1.5,-1.78; 10 -1.5,1.78; 11 -0.5,-1.78; 12 -0.5,1.78; 13 0.5,-1.78; 14 0.5,1.78; 15 1.5,-1.78; 16 1.5,1.78; 17 2.5,-1.78; 18 2.5,1.78; 19 3.5,-1.78; 20 3.5,1.78; 21 4.5,-1.78; 22 4.5,1.78; 23 5.5,-1.78; 24 5.5,1.78 | hole 0.76: -5,0; 5,0
ADIS1648X = smd 0.33 x 1.727: 1 5.512,-1.524; 2 5.512,1.524; 3 4.496,-1.524; 4 4.496,1.524; 5 3.505,-1.524; 6 3.505,1.524; 7 2.489,-1.524; 8 2.489,1.524; 9 1.499,-1.524; 10 1.499,1.524; 11 0.508,-1.524; 12 0.508,1.524; 13 -0.508,-1.524; 14 -0.508,1.524; 15 -1.499,-1.524; 16 -1.499,1.524; 17 -2.489,-1.524; 18 -2.489,1.524; 19 -3.505,-1.524; 20 -3.505,1.524; 21 -4.496,-1.524; 22 -4.496,1.524; 23 -5.512,-1.524; 24 -5.512,1.524 | hole 2.4: -19.8,-1.642; 19.8,-1.642; 19.8,40.958; -19.8,40.958
QFN65P400X400X80-17N = smd 0.86 x 0.32: 1 -1.935,0.975; 2 -1.935,0.325; 3 -1.935,-0.325; 4 -1.935,-0.975; 9 1.935,-0.975; 10 1.935,-0.325; 11 1.935,0.325; 12 1.935,0.975 | smd 0.32 x 0.86: 5 -0.975,-1.935; 6 -0.325,-1.935; 7 0.325,-1.935; 8 0.975,-1.935; 13 0.975,1.935; 14 0.325,1.935; 15 -0.325,1.935; 16 -0.975,1.935 | smd 2.5 x 2.5: 17 0,0
DFN300X300X90-9N = smd 0.813 x 0.305: 1 -1.524,0.762; 2 -1.524,0.254; 3 -1.524,-0.254; 4 -1.524,-0.762; 5 1.524,-0.762; 6 1.524,-0.254; 7 1.524,0.254; 8 1.524,0.762 | smd 1.6 x 1.88: 9 0,0
SOT23 = smd 1 x 1.4: 1 -0.95,-1.1; 2 0.95,-1.1; 3 0,1.1
ADIS1650X = smd 0.56 x 0.56: A1 0,0; A2 0,1.27; A3 0,2.54; A4 0,3.81; A5 0,5.08; A6 0,6.35; A7 0,7.62; A8 0,8.89; A9 0,10.16; A10 0,11.43; B1 1.27,0; B2 1.27,1.27; B3 1.27,2.54; B4 1.27,3.81; B5 1.27,5.08; B6 1.27,6.35; B7 1.27,7.62; B8 1.27,8.89; B9 1.27,10.16; B10 1.27,11.43; C1 2.54,0; C2 2.54,1.27; C3 2.54,2.54; C4 2.54,3.81; C5 2.54,5.08; C6 2.54,6.35; C7 2.54,7.62; C8 2.54,8.89; C9 2.54,10.16; C10 2.54,11.43; D1 3.81,0; D2 3.81,1.27; D3 3.81,2.54; D4 3.81,3.81; D5 3.81,5.08; D6 3.81,6.35; D7 3.81,7.62; D8 3.81,8.89; D9 3.81,10.16; D10 3.81,11.43; E1 5.08,0; E2 5.08,1.27; E3 5.08,2.54; E4 5.08,3.81; E5 5.08,5.08; E6 5.08,6.35; E7 5.08,7.62; E8 5.08,8.89; E9 5.08,10.16; E10 5.08,11.43; F1 6.35,0; F2 6.35,1.27; F3 6.35,2.54; F4 6.35,3.81; F5 6.35,5.08; F6 6.35,6.35; F7 6.35,7.62; F8 6.35,8.89; F9 6.35,10.16; F10 6.35,11.43; G1 7.62,0; G2 7.62,1.27; G3 7.62,2.54; G4 7.62,3.81; G5 7.62,5.08; G6 7.62,6.35; G7 7.62,7.62; G8 7.62,8.89; G9 7.62,10.16; G10 7.62,11.43; H1 8.89,0; H2 8.89,1.27; H3 8.89,2.54; H4 8.89,3.81; H5 8.89,5.08; H6 8.89,6.35; H7 8.89,7.62; H8 8.89,8.89; H9 8.89,10.16; H10 8.89,11.43; J1 10.16,0; J2 10.16,1.27; J3 10.16,2.54; J4 10.16,3.81; J5 10.16,5.08; J6 10.16,6.35; J7 10.16,7.62; J8 10.16,8.89; J9 10.16,10.16; J10 10.16,11.43; K1 11.43,0; K2 11.43,1.27; K3 11.43,2.54; K4 11.43,3.81; K5 11.43,5.08; K6 11.43,6.35; K7 11.43,7.62; K8 11.43,8.89; K9 11.43,10.16; K10 11.43,11.43
CRYSTAL-SMD-5X3.2-4PAD = smd 1.9 x 1.1: 1 -1.85,-1.15; 2 1.85,-1.15; 3 1.85,1.15; 4 -1.85,1.15

### Placement (x,y rotation side)
C1  11.57,5.36 270 bottom
C2  24,18.97 0 bottom
C3  11.18,13.35 270 bottom
C4  9.74,7.01 270 bottom
C5  27.18,6.6 90 bottom
C7  29.08,5.71 90 bottom
C8  34.89,29.12 180 bottom
C9  34.04,35.81 0 bottom
C10  37.31,32.64 270 bottom
C11  37.27,7.04 270 bottom
C12  31.74,6.46 90 bottom
D1  18.92,3.17 180 bottom
D2  6.6,3.17 180 bottom
FD1  1.78,5.08 0 top
FD2  41.91,42.16 0 top
FD3  1.78,5.08 0 bottom
FD4  41.91,42.16 0 bottom
J1  40.51,11.56 0 top
J2  43.18,22.61 270 bottom
J3  17.4,34.29 270 bottom
J4  43.69,32.51 90 bottom
R1  28.42,9.77 0 bottom
R2  32.14,19.92 90 bottom
R3  37.18,24.41 270 bottom
R4  37.22,19.6 90 bottom
R5  31.56,17.82 0 bottom
R6  31.56,16.45 0 bottom
R7  27.66,18.05 180 bottom
R8  5.65,6.32 180 bottom
R9  5.65,7.7 180 bottom
R10  5.65,4.94 180 bottom
R11  16,3.17 0 bottom
R12  29.72,32 180 bottom
R13  37.21,16.52 270 bottom
U1  19.05,11.3 90 bottom
U2  3.94,22.1 90 bottom
U3  3.94,22.1 270 top
U4  21.21,23.24 90 bottom
U6  34.67,32.64 90 bottom
U7  29.34,20.4 90 bottom
U8  10.29,16.34 0 top
Y1  34.64,5.77 270 bottom

### Tracks (layer width: path | path; a pad name or v marks a point on that pad's centre or on a via)
CS_MASTER  (via drill 0.25)
  Top 0.152: U3.6 6.36,18.59 7.49,17.46 7.49,15.54 | 7.49,15.54 7.49,10.2 v6.79,9.49 | v16.28,20.8 16.74,20.8 17.27,20.27 17.27,19.51 17.88,18.9 U8.G3 | v8.74,19.43 8.74,17.75 v9.42,17.07 | 7.49,15.54 v7.9,15.54
  Bottom 0.152: U1.20 13.17,9.05 13.14,9.08 7.2,9.08 v6.79,9.49 | v16.28,20.8 16.28,21.26 12.85,24.69 8.81,24.69 8.43,24.31 8.43,23.55 8.74,23.24 v8.74,19.43 | v7.9,15.54 v9.42,17.07
CS_SD  (via drill 0.25)
  Top 0.152: v33.08,13.96 33.66,14.53 33.66,26.41 v28.07,32
  Bottom 0.152: U1.50 28.61,14.55 29.21,13.96 v33.08,13.96 | J3.2 27.89,32.18 v28.07,32 R12.1
CS_SLAVE
  Bottom 0.152: U1.33 15.29,16.99 13.84,16.99 12.24,18.59 5.77,18.59 U2.6
DIO1_MASTER  (via drill 0.25)
  Top 0.152: U3.7 2.41,19.58 3.56,19.58 4.09,19.05 6.97,19.05 8.77,17.25 8.77,13.56 9.15,13.19 11.4,13.19 12.43,14.21 18.82,14.21 19.57,13.47 19.57,11.6 v20.11,11.06 | v29.77,21.61 29.77,18.56 29.22,18.01 29.22,17.55 29.94,16.82 29.94,12.95 v28.31,11.31 | U8.J6 21.15,23.39 24.52,23.39 v25.17,22.74
  Bottom 0.152: v20.11,11.06 v20.11,11.05 U1.57 26.86,11.05 27.12,11.31 v28.31,11.31 | U4.1 22.46,21.31 22.94,21.79 23.92,21.79 24.93,22.8 25.1,22.8 v25.17,22.74 29.34,22.74 29.77,22.31 v29.77,21.61
DIO1_SLAVE  (via drill 0.25)
  Top 0.152: v3.79,20.04 1.42,20.04 0.66,19.28 0.66,10.36 6.91,4.12 17.27,4.12 20.66,7.5 v20.66,11.55 | v31.89,10.94 31.89,11.21 30.57,12.53 30.57,22.79 v30.8,23.03
  Bottom 0.152: v31.89,10.94 31.74,11.1 29.23,11.1 28.44,11.89 25.97,11.89 25.63,11.55 U1.56 v20.66,11.55 | v30.8,23.03 30.53,23.3 24.85,23.3 23.81,22.27 U4.16 | v3.79,20.04 3.4,19.66 2.18,19.66 U2.7
DIO2_MASTER  (via drill 0.25)
  Top 0.152: v35.79,9.89 31.79,13.9 31.79,21.69 33.01,22.91 33.01,24.44 v32.76,24.69 32.74,24.69 32.44,24.99 v32.44,25.68 | U8.J3 20.78,18.55 v21.08,18.55 | v25.96,22.01 25.96,23.09 24.21,24.84 v23.6,24.84 | v1.65,28.65 0.89,27.89 0.89,21.18 1.42,20.65 2.41,20.65 U3.9
  Bottom 0.152: U1.62 31.8,8.56 32.05,8.8 34.7,8.8 v35.79,9.89 | U4.12 22.63,25.18 22.63,25.17 23.3,25.17 23.62,24.86 | 23.62,24.86 23.73,24.75 32.73,24.75 32.76,24.72 v32.76,24.69 | v21.08,18.55 20.96,18.55 20.55,18.96 20.55,19.42 20.85,19.72 23.67,19.72 v25.96,22.01 | v23.6,24.84 23.62,24.86 | v1.65,28.65 10.19,28.65 10.26,28.57 29.54,28.57 v32.44,25.68
DIO2_SLAVE  (via drill 0.25)
  Top 0.152: v31.98,24.26 32.3,24.26 32.68,23.88 32.68,23.17 31.48,21.98 31.48,13.51 v35.05,9.94
  Bottom 0.152: U4.13 23.16,24.23 31.95,24.23 v31.98,24.26 32.19,24.05 32.88,24.05 33.24,24.41 33.24,24.89 32.96,25.17 32.03,25.17 31.87,25.33 31.87,25.51 31.62,25.77 31.09,25.77 30.9,25.57 24.19,25.57 23.62,26.14 9.05,26.14 7.08,28.12 0.81,28.12 0.66,27.96 0.66,21.26 1.27,20.65 2.11,20.65 U2.9 | v35.05,9.94 34.23,9.11 31.91,9.11 31.85,9.05 U1.61
DIO3_MASTER  (via drill 0.25)
  Top 0.152: v16.68,11.51 16.68,12.08 16.24,12.52 12.82,12.52 8.83,8.53 3.39,8.53 2.18,9.74 2.18,11.9 1.58,12.51 1.58,15.88 2.28,16.59 U3.1
  Bottom 0.152: U4.9 19.04,25.18 17.5,23.63 17.5,21.57 18.23,20.84 18.23,18.73 17.3,17.8 U1.37 17.3,16.18 17.48,16 17.48,12.01 16.98,11.51 v16.68,11.51
DIO3_SLAVE  (via drill 0.25)
  Top 0.152: v4.42,12.34 3.94,12.83 v3.94,15.85 | v8.43,12.25 8.89,11.8 11.12,11.8 12.91,13.59 18.05,13.59 18.35,13.29 v18.35,13.11
  Bottom 0.152: U4.8 19.26,24.21 18.52,24.21 17.8,23.5 17.8,21.69 18.53,20.97 18.53,18.59 17.8,17.86 U1.38 17.8,13.66 v18.35,13.11 | v3.94,15.85 3.25,16.54 2.18,16.54 U2.1 | v8.43,12.25 8.34,12.34 v4.42,12.34
DIO4_MASTER  (via drill 0.25)
  Top 0.152: v5.87,13.69 5.46,14.1 U3.2
  Bottom 0.152: U4.4 20.23,20.61 19.8,20.18 U1.42 19.79,16.92 19.79,12.04 18.72,10.97 16.24,10.97 15.47,11.73 15.47,14.27 14.32,15.42 9.5,15.42 7.76,13.69 v5.87,13.69
DIO4_SLAVE  (via drill 0.25)
  Top 0.152: v19.09,13.27 18.45,13.91 12.56,13.91 11.49,12.84 9.01,12.84 8.38,13.46 8.38,15.74 8.11,16.01 v8.11,16.61
  Bottom 0.152: U4.5 19.49,22.04 19.49,18.16 19.3,17.97 U1.41 19.3,13.48 v19.09,13.27 | v8.11,16.61 5.77,16.61 U2.2
GND  (via drill 0.25)
  Top 0.254: J1.5 44.96,11.56
  Bottom 0.152: U1.63 25.86,8.05 26.45,7.45 C5.2 | U4.2 21.53,22.3 21.72,22.48 21.72,22.73 21.27,23.18 | 21.27,23.18 U4.17 | U4.3 20.88,22.79 21.27,23.18
  Bottom 0.254: J2.A12 40.61,19.61 J2.B1 | J2.A1 40.61,25.61 J2.B12
  Bottom 0.305: 36.07,32.26 36.07,32.13 | U6.2 34.93,32 35.18,32.26 34.8,32.64 U6.9
  other vias: 37.24,17.96 9.53,33.27 9.53,32.26 9.53,31.24 24,4.45 25.68,17.65 31.05,9.72 27.18,34.38 31.45,30.45 30.62,26.76 19.95,10.12 30.47,7.07 22.06,14.94 9.87,14.26 33,22.01 17.21,18.41 16.02,23.35 17.42,20.91 22.06,10.15 23.31,10.33 23.86,17.65 23.15,20.63 5.78,10.24
  pour Bottom (rank 2): -0.38,44.07 -0.38,0.13 47.5,0.13 47.5,44.07
  pour Top (rank 2): -0.38,44.07 -0.38,0.13 47.5,0.13 47.5,44.07
  pour Bottom (no thermals): 33.27,33.46 33.27,31.8 36.07,31.8 36.07,33.46
IMU_RST  (via drill 0.25)
  Top 0.152: v7.52,19.58 5.46,19.58 U3.8 | v16.05,19.28 16.24,19.28 U8.F3
  Bottom 0.152: U2.8 5.77,19.58 v7.52,19.58 8.2,18.9 15.06,18.9 15.44,19.28 v16.05,19.28
MISO_MASTER  (via drill 0.25)
  Top 0.152: v6.68,10.97 6.38,11.28 6.38,16.05 6.79,16.46 6.79,17.13 6.31,17.6 U3.4 | v22.12,8.96 22.59,9.43 22.59,17.6 22.05,18.15 21.45,18.15 21.37,18.06 20.79,18.06 20.72,18.14 19.54,18.14 19.18,18.5 19.18,18.82 U8.H3
  Bottom 0.152: v6.68,10.97 7.6,10.05 U1.22 13.39,9.98 14.91,9.98 15.9,8.99 22.09,8.99 v22.12,8.96
MISO_SD  (via drill 0.25)
  Top 0.152: v34.12,12.97 34.3,13.16 34.3,30.08 v29.93,34.45
  Bottom 0.152: v29.93,34.45 29.93,35.9 28.15,37.69 J3.7 | v34.12,12.97 29.12,12.97 28.55,13.55 U1.52
MISO_SLAVE
  Bottom 0.152: U1.35 16.3,15.97 16.86,15.41 16.86,12.82 16.63,12.59 16.02,12.59 15.78,12.83 15.78,14.39 12.58,17.59 5.73,17.59 U2.4
MOSI_MASTER  (via drill 0.25)
  Top 0.152: U3.5 2.03,18.59 1.27,17.83 1.27,12.13 v1.68,11.72 | v13.45,15.9 14.51,14.84 19.34,14.84 19.8,15.3 19.8,16.76 19.47,17.1 18.97,17.1 18.67,17.39 18.67,19.27 18.94,19.54 19.45,19.54 19.84,19.93 19.84,23 19.53,23.32 18.54,23.32 U8.G6
  Bottom 0.152: U1.23 11.18,10.55 | 11.18,10.55 7.8,10.55 6.83,11.53 1.9,11.53 1.71,11.72 v1.68,11.72 | 11.18,10.55 11.18,11.35 10.87,11.66 10.45,11.66 8.93,13.18 5.57,13.18 5.38,13.37 5.38,13.99 5.57,14.17 7.82,14.17 9.37,15.73 13.31,15.73 13.46,15.88 13.46,15.89 v13.45,15.9
MOSI_SD  (via drill 0.25)
  Top 0.152: v32.27,33.06 32.42,32.9 34.62,30.7 v34.62,12.47
  Bottom 0.152: v34.62,12.47 29.16,12.47 28.58,13.05 U1.53 | v32.27,33.06 32.03,33.29 24.57,33.29 J3.3
MOSI_SLAVE  (via drill 0.25)
  Top 0.152: v3.79,18.67 3.4,19.05 1.5,19.05 0.97,18.52 0.97,10.52 3.25,8.23 8.96,8.23 12.77,12.04 v16.04,12.04
  Bottom 0.152: U1.36 16.8,16.03 17.16,15.66 17.16,12.31 16.89,12.04 v16.04,12.04 | v3.79,18.67 2.18,18.67 U2.5
N$1
  Bottom 0.152: U1.60 26.17,9.55 26.29,9.68 27.66,9.68 27.7,9.63 R1.2
N$2
  Bottom 0.152: J2.A5 37.4,23.6 R3.2
N$3  (via drill 0.25)
  Top 0.152: v41.47,21.77 41.21,21.51 37.39,21.51 v37.21,21.34
  Bottom 0.152: J2.B5 41.31,21.86 41.4,21.77 v41.47,21.77 | v37.21,21.34 37.22,21.32 R4.2
N$4
  Bottom 0.33: J4.3 38.89,34.51 37.59,35.81 C9.1
  Bottom 0.508: U6.6 34.42,34.54 34.94,35.06 C9.1
  pour Bottom (no thermals): 33.53,34.54 33.53,33.77 35.05,33.77 35.05,34.67 35.31,34.92 35.31,36.45 34.42,36.45 34.42,35.43
N$5
  Bottom 0.152: R2.2 32,20.37 30.47,20.37 U7.3
N$6
  Bottom 0.152: U6.8 36.64,34.16 C10.1
N$7
  Bottom 0.152: U1.8 19.3,3.94 19.93,3.31 D1.C
N$8  (via drill 0.25)
  Top 0.152: v19.18,7.54 19.18,6.91 18.74,6.48 9.14,6.48 7.9,5.24 v7.9,4.94
  Bottom 0.152: U1.9 18.8,6.56 19.15,6.91 19.15,7.54 v19.18,7.54 | v7.9,4.94 7.9,3.6 D2.C
N$9  (via drill 0.25)
  Top 0.152: v18.67,7.11 18.54,6.99 9.14,6.99 8.64,6.48 v7.87,6.48
  Bottom 0.152: U1.10 18.3,6.74 v18.67,7.11 | v7.87,6.48 7.72,6.33 R8.2
N$10  (via drill 0.25)
  Top 0.152: v7.87,7.62 8.26,7.24 8.89,7.24 9.17,7.52 v18.15,7.52
  Bottom 0.152: U1.11 17.8,7.17 v18.15,7.52 | v7.87,7.62 6.31,7.62 R9.2
N$11
  Bottom 0.152: R10.1 5.07,3.83 D2.A
N$12
  Bottom 0.152: D1.A R11.1
N$13
  Bottom 0.152: R13.2 37.04,15.77 23.68,15.77 23.25,15.34 23.25,12.71 22.91,12.38 20.53,12.38 20.26,12.65 20.26,16.93 U1.43
N$14
  Bottom 0.152: U1.6 20.3,4.59 22.26,2.64 34.07,2.64 34.65,3.22 34.65,7.19 35.07,7.62 Y1.1 C11.1 | C11.1
N$15
  Bottom 0.152: U1.5 20.8,4.6 21.59,3.81 30.99,3.81 31.74,4.56 | Y1.3 32.82,4.59 31.77,4.59 31.74,4.56 | C12.1 31.74,4.56
NRST  (via drill 0.25)
  Top 0.152: J1.3 42.42,10.29 41.53,10.29 41.15,10.67 39.75,10.67 33.96,4.88 v31.05,4.88
  Bottom 0.152: U1.7 19.8,6.46 20.07,6.73 23.11,6.73 25.31,4.53 28.75,4.53 C7.1 29.09,4.88 v31.05,4.88
SCLK_MASTER  (via drill 0.25)
  Top 0.152: U3.3 3.25,17.6 3.71,18.06 6.38,18.06 7.18,17.25 7.18,14.93 v7.01,14.75 7.18,14.57 7.18,10.73 v6.68,10.23 | U8.H6 19.18,22.63 18.87,22.63 18.34,22.1 16.25,22.1 15.99,21.84 15.99,21.31 15.5,20.82 15.03,20.82 14.68,20.47 14.68,19.96 14.24,19.52 13.71,19.52 13.45,19.26 13.45,18.73 12.85,18.14 11.24,18.14 10.99,17.89 10.99,17.18 v11.18,16.99
  Bottom 0.152: U1.21 7.47,9.55 6.79,10.23 v6.68,10.23 | v11.18,16.99 10.03,16.99 7.79,14.75 v7.01,14.75
SCLK_SD  (via drill 0.25)
  Top 0.152: v33.62,13.47 33.98,13.84 33.98,29.52 v29.08,34.42
  Bottom 0.152: v33.62,13.47 29.14,13.47 28.56,14.05 U1.51 | v29.08,34.42 28.02,35.48 J3.5
SCLK_SLAVE  (via drill 0.25)
  Top 0.152: v16.33,13.09 16.14,12.91 12.73,12.91 10.99,11.17 v10.63,11.17
  Bottom 0.152: v10.63,11.17 10.2,11.17 8.49,12.88 4.01,12.88 0.66,16.23 0.66,17.22 1.04,17.6 U2.3 | v16.33,13.09 16.53,13.3 16.53,15.27 15.8,16 U1.34
SW_IN1  (via drill 0.25)
  Top 0.152: v33.1,10.43 30.87,12.65 30.87,22.39 31.53,23.05 v31.53,23.29
  Bottom 0.152: v33.1,10.43 31.66,10.43 31.33,10.77 27.19,10.77 26.98,10.55 U1.58 | v31.53,23.29 31.21,23.62 24.39,23.62 23.69,22.92 U4.15
SW_IN2  (via drill 0.25)
  Top 0.152: v34.34,9.92 31.18,13.08 31.18,22.21 32.2,23.22 v32.2,23.56
  Bottom 0.152: U1.59 26.92,10.05 27.32,10.45 31.2,10.45 31.73,9.92 v34.34,9.92 | U4.14 23.59,23.57 23.95,23.93 31.63,23.93 31.78,23.78 31.98,23.78 v32.2,23.56
SW_IN3
  Bottom 0.152: U1.39 18.3,17.92 18.85,18.47 18.85,21.08 18.29,21.64 18.29,23.25 18.61,23.56 19.27,23.56 U4.7
SW_IN4
  Bottom 0.152: U1.40 18.8,17.95 19.17,18.31 19.17,21.2 18.6,21.76 18.6,22.79 18.72,22.91 U4.6
SW_SD  (via drill 0.25)
  Top 0.152: v35.19,25.87 35.13,25.81 v35.13,11.95
  Bottom 0.152: v35.13,11.95 29.25,11.95 28.65,12.55 U1.54 | J3.9 11.05,32.43 14.35,29.13 31.93,29.13 v35.19,25.87
SWO  (via drill 0.25)
  Top 0.152: J1.6 44.7,12.57 44.7,12.87 45.41,13.58 45.41,15.02 44.38,16.06 36.32,16.06 35.64,15.38 v35.64,11.49
  Bottom 0.152: U1.55 25.7,12.05 25.88,12.24 28.53,12.24 29.31,11.46 35.61,11.46 v35.64,11.49
TCK  (via drill 0.25)
  Top 0.152: v42.1,15.46 42.1,13.03 42.94,12.19 J1.4
  Bottom 0.152: U1.49 28.58,15.05 29.2,14.44 38.06,14.44 39.62,16 41.66,16 42.1,15.56 v42.1,15.46
TMS  (via drill 0.25)
  Top 0.152: v21.9,13.6 21.47,13.17 21.47,7.45 22.72,6.2 34.77,6.2 39.5,10.92 39.5,12.06 39.88,12.45 41.15,12.45 41.4,12.19 J1.2
  Bottom 0.152: U1.46 21.8,16.17 21.54,15.91 21.54,13.95 v21.9,13.6
USB+_N  (via drill 0.25)
  Top 0.152: v38.65,22.01 38.85,22.01 39.7,22.86 v41.47,22.86
  Bottom 0.152: R6.1 32.45,16.45 32.8,16.8 35.82,16.8 36.35,17.34 36.35,21.78 37.02,22.45 39.06,22.45 J2.A7 38.74,22.11 v38.65,22.01 | J2.B7 v41.47,22.86
USB+_P
  Bottom 0.152: R2.1 R5.1 32.14,17.73 32.76,17.11 35.69,17.11 36.04,17.46 36.04,21.91 36.89,22.76 39.06,22.76 J2.A6 40.16,22.36 J2.B6
USB_N
  Bottom 0.152: R6.2 30.74,16.21 23.66,16.21 22.94,15.49 22.94,12.92 22.7,12.68 20.96,12.68 20.8,12.84 U1.44
USB_P
  Bottom 0.152: R5.2 30.83,17.82 29.53,16.52 23.54,16.52 22.61,15.58 22.61,13.23 22.42,13.04 21.42,13.04 21.23,13.23 21.23,14.67 21.24,14.67 21.24,16.91 U1.45
USB_PU  (via drill 0.25)
  Top 0.152: v32.29,21.43 32.58,21.14 v32.58,14.99
  Bottom 0.152: R7.2 28.24,19.36 | 28.24,19.36 U7.1 28.24,19.51 U7.1 | v32.58,14.99 29.17,14.99 28.7,15.45 23.84,15.45 23.55,15.17 23.55,12.59 23,12.04 20.22,12.04 18.85,10.67 15.08,10.67 14.77,10.97 14.77,11.95 14.8,11.98 14.8,13.75 14.5,14.05 U1.30 | v32.29,21.43 31.8,21.43 31.5,21.12 29.58,21.12 29.39,20.93 29.39,20.5 28.24,19.36
V_USB  (via drill 0.25)
  Top 0.305: v38.23,20.7 36.45,20.7 35.79,21.36 35.79,25.62 v36.05,25.88 v36.04,25.89
  Bottom 0.152: v38.23,20.7 38.06,20.54 38.06,17.36 37.8,17.1 R13.1
  Bottom 0.254: J2.A4 39.9,24.11 40.15,23.86 J2.B9 | J2.B4 40.15,21.36 39.9,21.11 J2.A9 38.63,21.11 v38.23,20.7
  Bottom 0.305: J2.A4 38.76,24.11 38.35,24.51 38.35,25.55 37.94,25.97 36.12,25.97 v36.04,25.89 33.91,28.02 U6.4
  Bottom 0.508: U6.4 33.91,29.2 C8.1
  pour Bottom (no thermals): 33.71,31.5 33.71,29.59 34.26,29.59 34.26,30.35 35.69,30.35 35.69,31.5 35.31,31.5 35.31,30.61 34.54,30.61 34.54,31.5
VDD  (via drill 0.25)
  Top 0.152: v26.03,6.71 29.28,6.71 30.25,7.68 30.25,17.19 v29.7,17.74 30.26,18.31 30.26,23.18 30.61,23.53 30.93,23.53 31.41,24.02 31.41,25.2 v31.36,25.25 31.36,27.37 25.47,33.25 v25.47,34.67 25.47,35.31 | v25.66,5.71 23.62,5.71 v23.39,5.49 23.37,5.41 22.38,4.42 v18.8,4.42 | v15.3,11.16 15.3,8.94 15.29,8.93 v15.29,8.9 | U8.K6 21.69,22.63 21.62,22.63 20.47,21.49 U8.J5 20.46,21.41 20.46,20.17 U8.J4 20.45,20.12 21.11,19.46 v21.11,19.23 | U8.H1 U8.G1 17.53,16.34 16.86,17.01 16.28,17.01 15.99,17.3 15.99,18.27 15.44,18.82 U8.E3 15.37,18.9 15.37,18.97 v14.91,19.43 | U8.D6 14.07,22.71 14.07,22.78 v13.61,23.24 12.85,24 U8.C7 | v8.97,24.16 8.87,24.16
  Top 0.33: v42.42,32.51 42.42,30.35 41.91,29.84 38.1,29.84 37.59,30.35 37.59,33.91 36.2,35.31 v31.9,35.31 25.47,35.31 10.16,35.31 8.87,34.01 8.87,24.16 8.87,22.53 7.93,21.59 U3.12 | U3.12 U3.10 | U3.12 U3.11
  Bottom 0.152: C4.1 10.44,8.56 13.37,8.56 U1.19 14.94,8.55 v15.29,8.9 | C5.1 26.38,5.75 | 26.38,5.75 26.03,6.1 v26.03,6.71 26.03,7.42 25.9,7.55 U1.64 | v23.39,5.49 23.25,5.63 U1.1 | R12.2 32.15,32 32.78,32.63 32.78,33.84 31.9,34.72 v31.9,35.31 | v31.36,25.25 31.28,25.18 23.97,25.18 23.31,25.84 21.79,25.84 21.53,25.58 U4.11 | C4.1 8.51,6.63 8.51,6.01 8.26,5.76 7.58,5.76 6.77,4.95 6.24,4.95 R10.2 | 26.38,5.75 25.7,5.75 v25.66,5.71 | C4.1 11.06,7.86 11.57,7.35 C1.1 12.81,6.21 13.59,6.99 16.38,6.99 16.8,6.57 U1.13 16.8,4.61 | 16.8,4.61 16.26,4.06 15.87,4.06 15.42,3.61 R11.2 | C3.1 12.03,15.05 U1.32 14.16,15.05 15.15,14.07 15.15,11.32 v15.3,11.16 | v18.8,4.42 18.64,4.57 16.81,4.57 16.8,4.61 | J3.4 25.2,34.39 25.47,34.66 v25.47,34.67 | v29.7,17.74 28.81,16.86 24.86,16.86 | 24.86,16.86 22.91,16.86 U1.48 22.76,16.99 22.76,17.91 21.43,19.23 v21.11,19.23 | U7.2 27.23,21.35 C2.1 24.85,16.87 24.86,16.86 | v14.91,19.43 14.91,21.95 v13.61,23.24 12.7,24.16 v8.97,24.16
  Bottom 0.33: J4.2 v42.42,32.51
VIN  (via drill 0.25)
  Top 0.33: 8.23,34.39 9.78,35.94 36.96,35.94 38.61,34.29 v38.61,31.24 | v8.23,23.05 8.23,34.39 | 8.23,34.39
  Bottom 0.152: 2.18,21.64 U2.11 | 5.77,21.57 U2.12
  Bottom 0.305: 40.43,30.61 J4.1
  Bottom 0.33: 40.43,30.61 v38.61,30.61 v38.61,31.24 | v8.23,23.05 8.23,22.38 7.41,21.57 5.77,21.57 5.72,21.52 U2.10 | 5.67,21.64 2.18,21.64
  Bottom 0.406: U2.12 5.67,21.64

### Text on the board
tPlace: USB | iSensor SPI Buffer | EXT | ADIS1650X | SWD | This side up! | J.Chong 06/2020 | RevB